# Altium schematic sheet [02] - BLOCK DIAGRAM.SchDoc
size A2; DocumentNumber: 2; SheetNumber: 2; SheetTotal: 10; PageSetup: Record=PageOptions|CenterHorizontal=True|CenterVertical=True|PrintScale=0.52|XCorrection=1.00|YCorrection=1.00|PrintKind=1|BorderSize=5000000|LeftOffset=0|BottomOffset=0|Orientation=2|PaperLength=1000|PaperWidth=1000|Scale=100|PaperSource=4|PrintQuality=600|MediaType=1|DitherType=10|PrintScaleMode=1|PaperKind=A4|PaperIndex=9
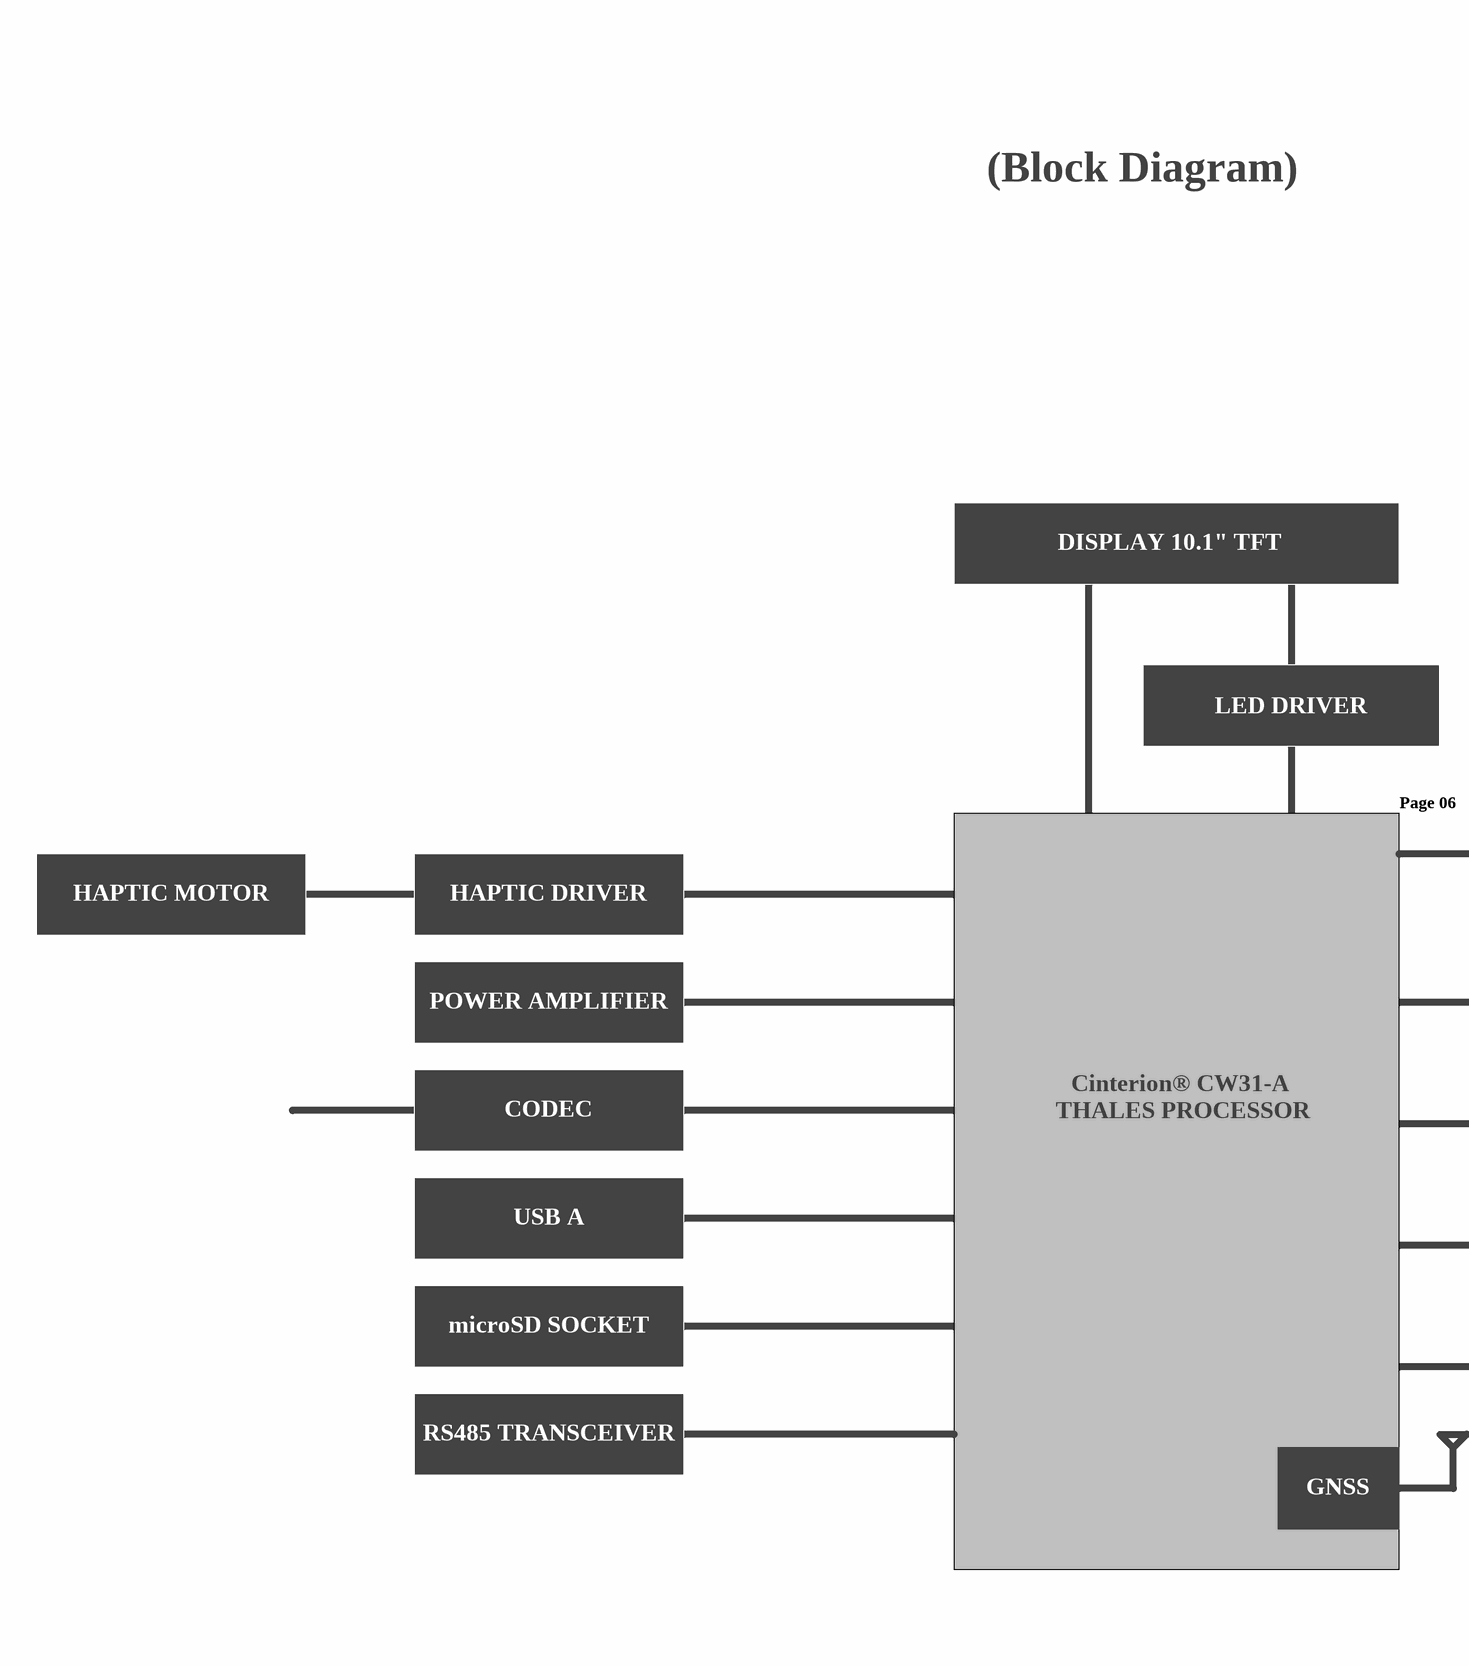
[diagram p0: [02] - BLOCK DIAGRAM.SchDoc, left]
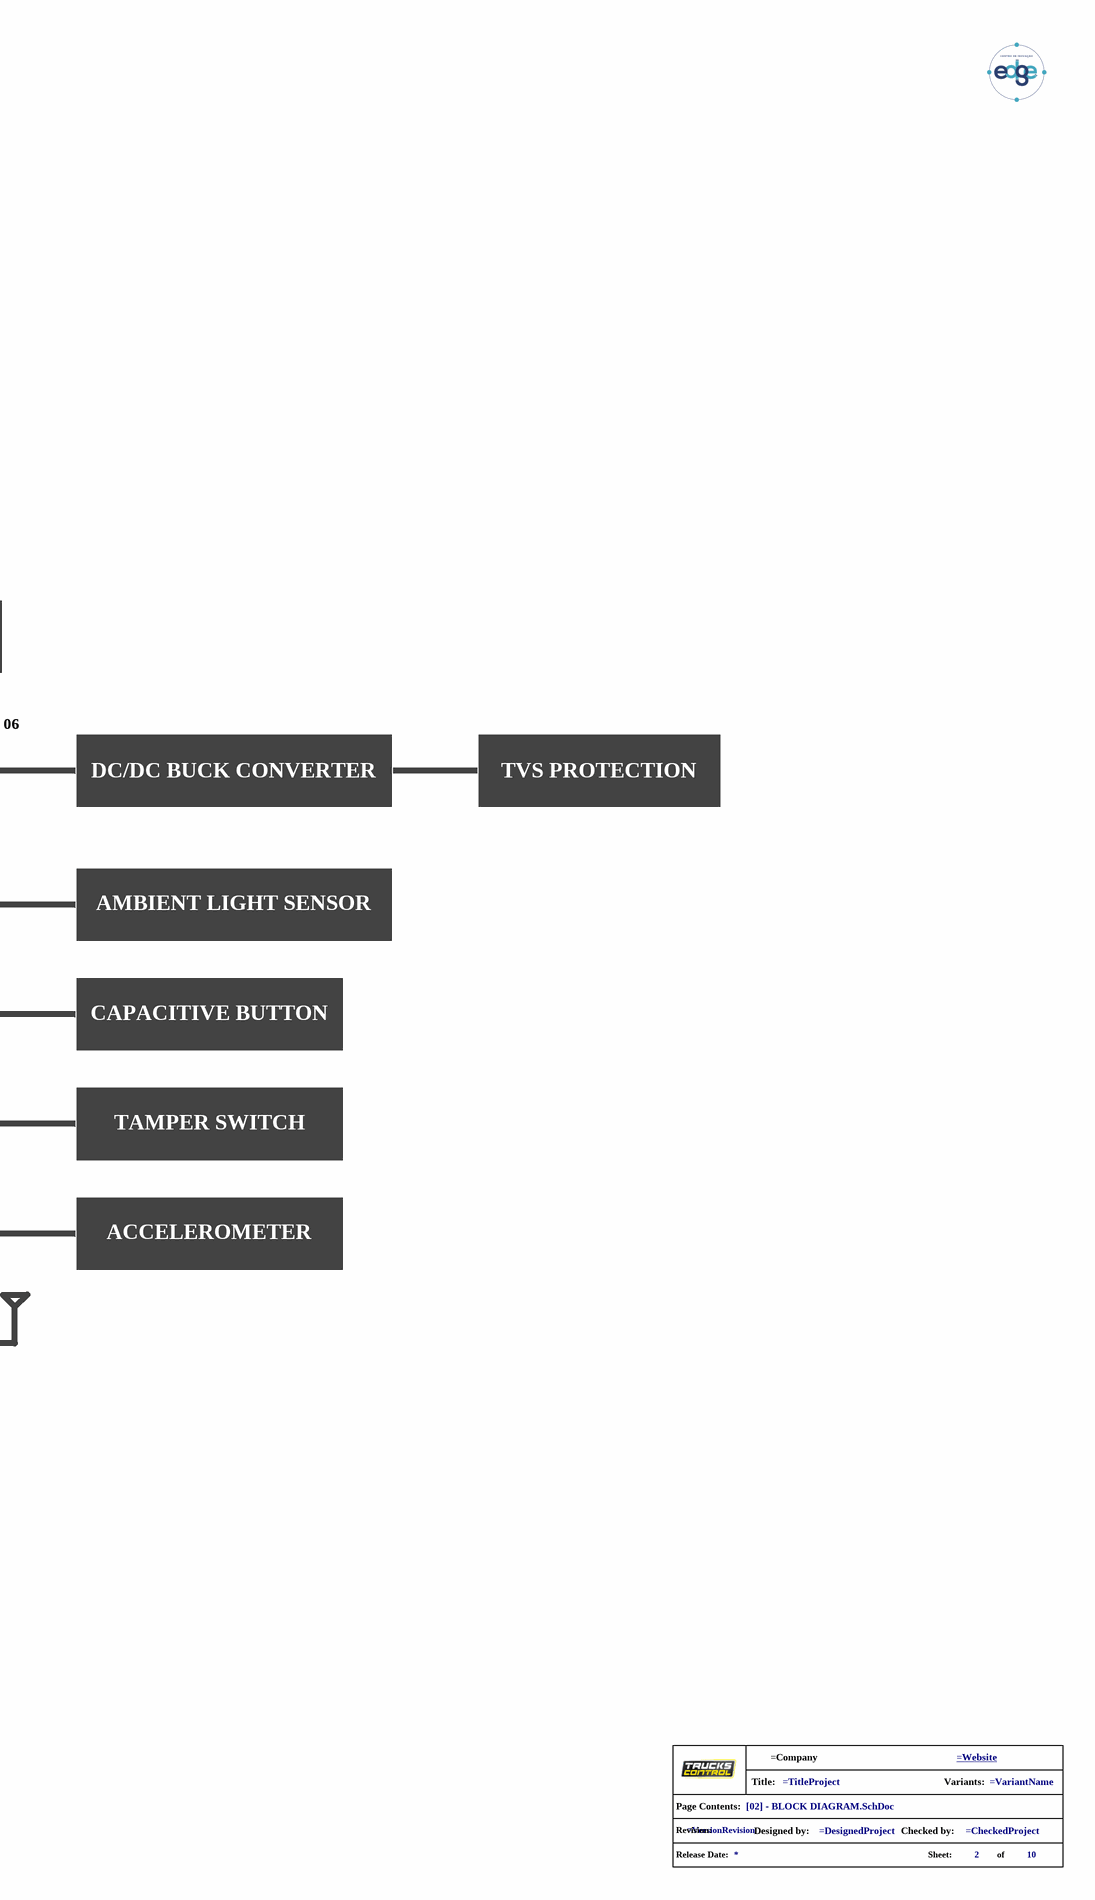
[diagram p1: [02] - BLOCK DIAGRAM.SchDoc, right]

## Parts
*?  info_project  (value not drawn)  (graphical)

## Notes on the sheet
- (Block Diagram)
- DISPLAY 10.1" TFT
- LED DRIVER
- Page 06
- DC/DC BUCK CONVERTER
- TVS PROTECTION
- HAPTIC MOTOR
- HAPTIC DRIVER
- POWER AMPLIFIER
- AMBIENT LIGHT SENSOR
- CODEC
- Cinterion® CW31-A
- THALES PROCESSOR
- CAPACITIVE BUTTON
- USB A
- TAMPER SWITCH
- microSD SOCKET
- ACCELEROMETER
- RS485 TRANSCEIVER
- GNSS
- (in symbol info_project) Title:; Variants:; Page Contents:; Revision:; Designed by:; Checked by:; Release Date:; Sheet:; of

## Library data of the parts
*? = info_project: GRAPHICAL - Info Project